# Altium schematic sheet MicroMod_SAMD51.SchDoc: MicroMod_SAMD51
size 457 x 318 mm; Origin: Eagle; Date: 5/10/2021 9:59:38 PM; SheetNumber: 1; DESIGNER: DESIGNER; REV: REV; GateName_1: G$1; SymbolName_1: FRAME_LEDGER; LibraryName: SparkFun-Aesthetics; DeviceSetName: FRAME-LEDGER; GateName_2: G$2; SymbolName_2: DOCFIELD; Sheet: Sheet:; ReleasedundertheCreativeCommons: Released under the Creative Commons; AttributionShare-Alike4.0License: Attribution Share-Alike 4.0 License; https://creativecommons.org/licenses/by-sa/4.0/: https://creativecommons.org/licenses/by-sa/4.0/; Designby: Design by:
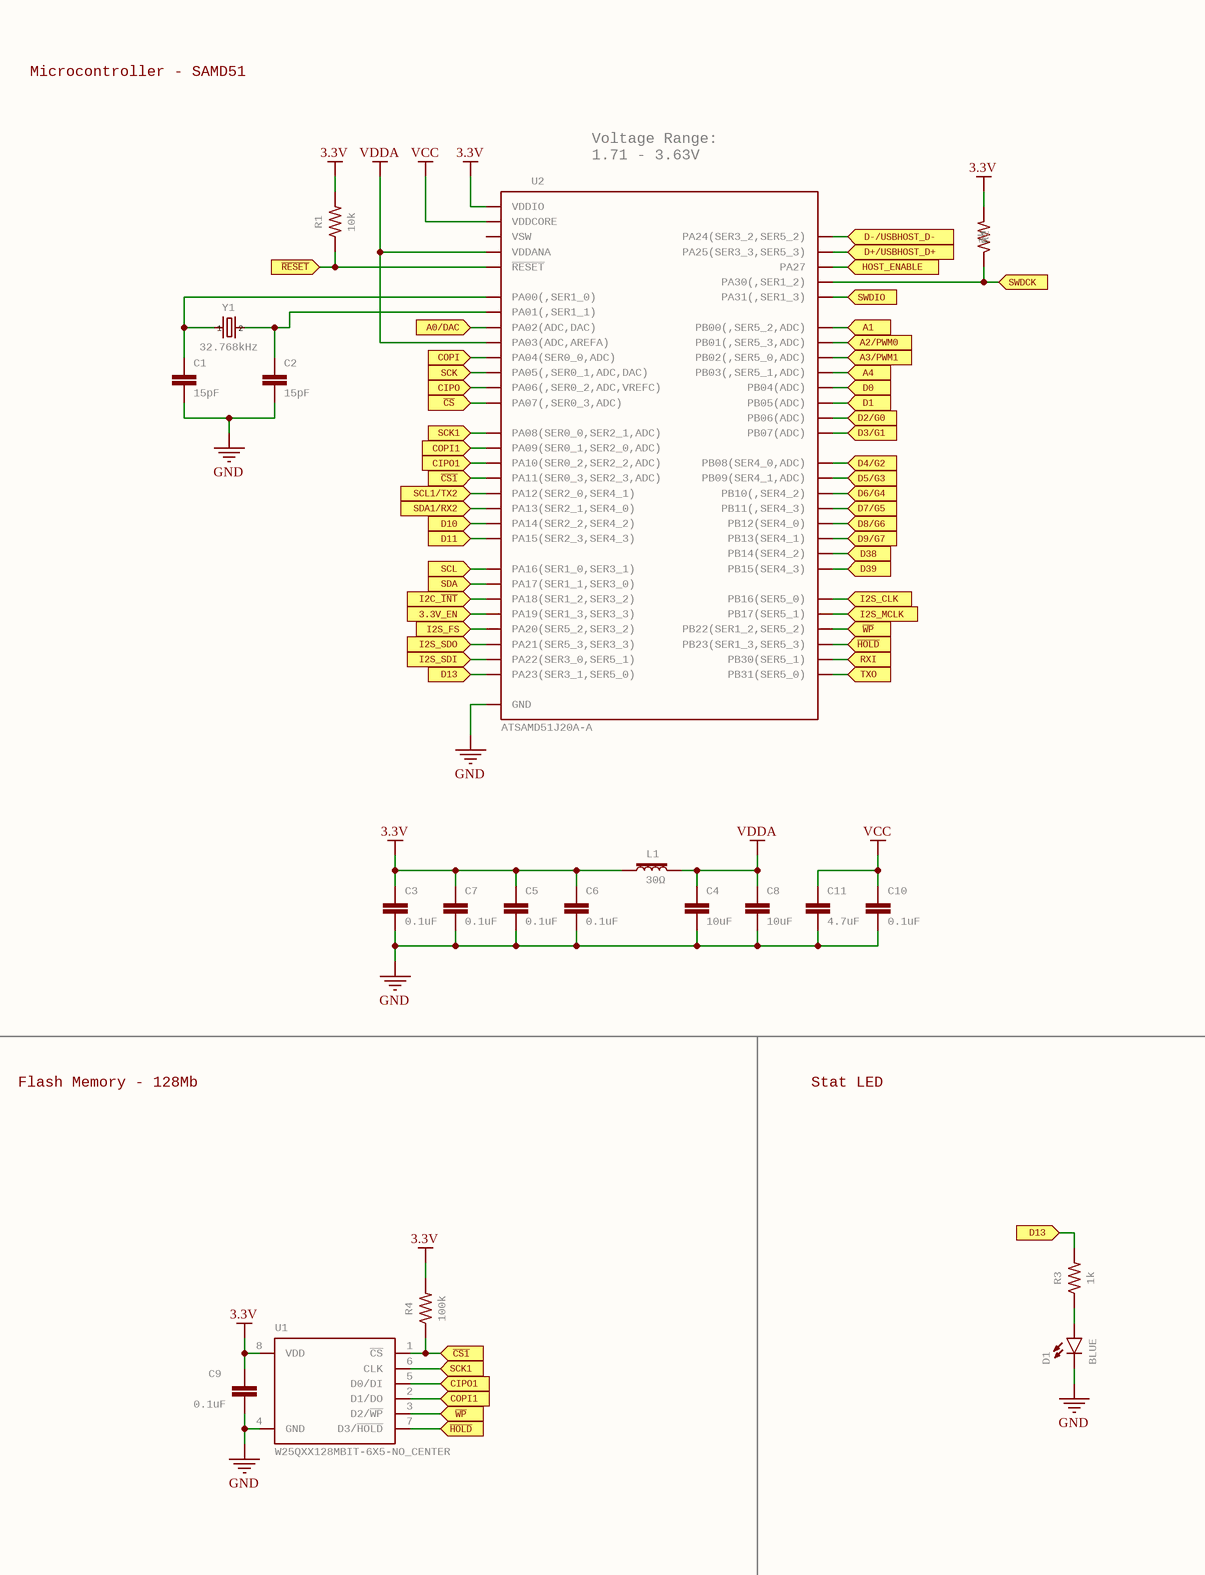
[diagram p0: MicroMod_SAMD51.SchDoc, left]
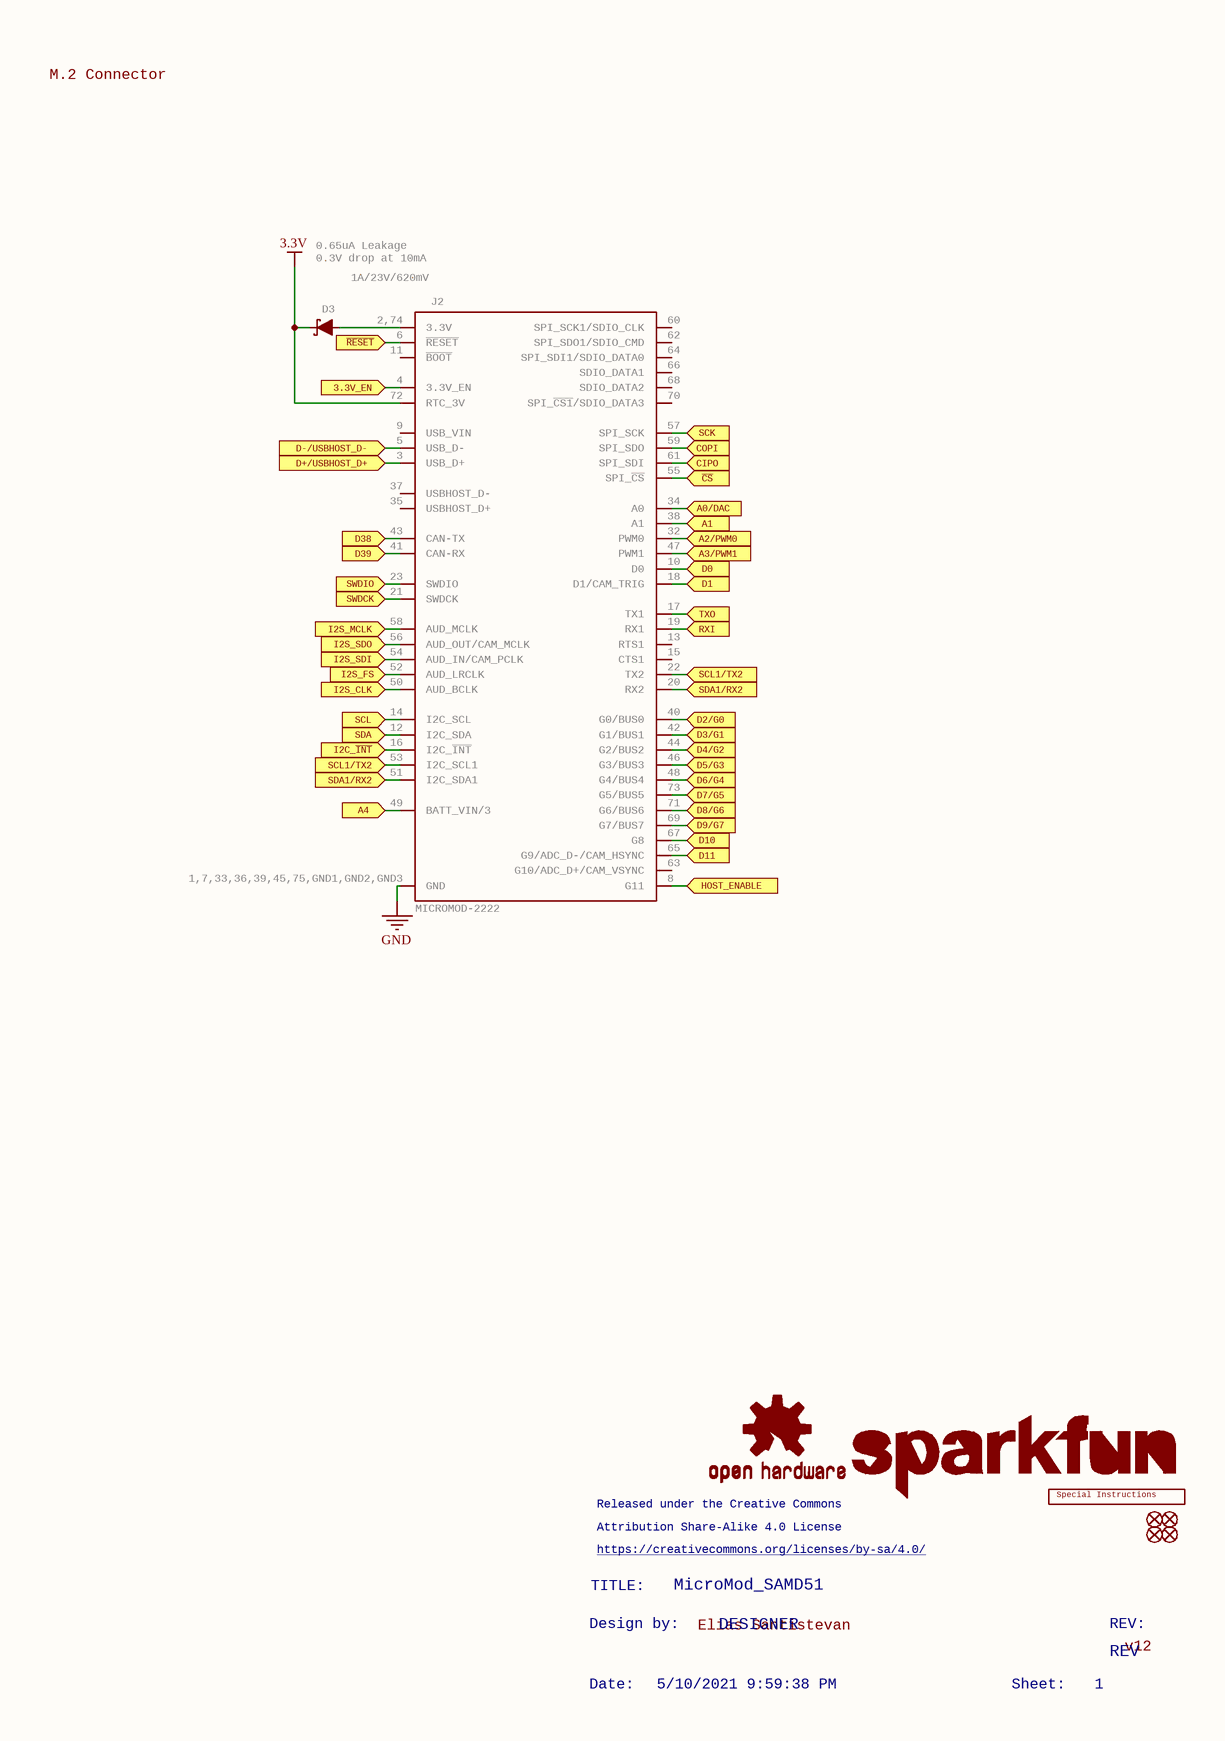
[diagram p1: MicroMod_SAMD51.SchDoc, right]

## Parts
C1  15pF  [0402-TIGHT]
C2  15pF  [0402-TIGHT]
C3  0.1uF  [0402-TIGHT]
C4  10uF  [0402-TIGHT]
C5  0.1uF  [0402-TIGHT]
C6  0.1uF  [0402-TIGHT]
C7  0.1uF  [0402-TIGHT]
C8  10uF  [0402-TIGHT]
C9  0.1uF  [0402-TIGHT]
C10  0.1uF  [0402-TIGHT]
C11  4.7uF  [0402-TIGHT]
D1  BLUE  [LED-0603]
D3  1A/23V/620mV  [SOD-323]
FD5  FIDUCIALUFIDUCIAL  [FIDUCIAL-MICRO]  (value not drawn)
FD6  FIDUCIALUFIDUCIAL  [FIDUCIAL-MICRO]  (value not drawn)
FD7  FIDUCIALUFIDUCIAL  [FIDUCIAL-MICRO]  (value not drawn)
FD8  FIDUCIALUFIDUCIAL  [FIDUCIAL-MICRO]  (value not drawn)
J2  MICROMOD-2222  [M.2-CARD-E-22]
L1  30Ω  [0402-TIGHT]
LOGO2  OSHW-LOGOMINI  [OSHW-LOGO-MINI]  (value not drawn)
LOGO5  SpecialInstructions: Special Instructions  [ORDERING_INSTRUCTIONS]  (hidden comment: SPECIAL_INSTRUCTIONS-ORDERING)
LOGO6  SFE_LOGO_NAME.1_INCH  [SFE_LOGO_NAME_.1]  (value not drawn)
R1  10k  [0402-TIGHT]
R2  1k  [0402-TIGHT]
R3  1k  [0402-TIGHT]
R4  100k  [0402-TIGHT]
U1  W25QXX128MBIT-6X5-NO_CENTER  [WSON-8-6X5-NO_CENTERPAD]
U2  ATSAMD51J20A-A  [TQFP64]
Y1  32.768kHz  [CRYSTAL-SMD-3.2X1.5MM]

## Ports
3.3V_EN (in), A0/DAC (in), A1 (in), A2/PWM0 (in), A3/PWM1 (in), A4 (in), CIPO1 (in), CIPO (in), COPI1 (in), COPI (in), D0 (in), D1 (in), D2/G0 (in), D3/G1 (in), D4/G2 (in), D5/G3 (in), D6/G4 (in), D7/G5 (in), D8/G6 (in), D9/G7 (in), D10 (in), D11 (in), D13 (in), D38 (in), D39 (in), D+/USBHOST_D+ (in), D-/USBHOST_D- (in), HOST_ENABLE (in), I2C_~{INT} (in), I2S_CLK (in), I2S_FS (in), I2S_MCLK (in), I2S_SDI (in), I2S_SDO (in), RXI (in), SCK1 (in), SCK (in), SCL1/TX2 (in), SCL (in), SDA1/RX2 (in), SDA (in), SWDCK (in), SWDIO (in), TXO (in), ~{CS1} (in), ~{CS} (in), ~{HOLD} (in), ~{RESET} (in), ~{WP} (in)

## Nets
3.3V: C3.1 C5.1 C6.1 C7.1 C9.1 D3.C J2.72(RTC_3V) L1.1 R1.2 R2.2 R4.2 U1.8(VDD) U2.21,34,48,56(VDDIO)
GND: C1.2 C2.2 C3.2 C4.2 C5.2 C6.2 C7.2 C8.2 C9.2 C10.2 C11.2 D1.C J2.1,7,33,36,39,45,75,GND1,GND2,GND3(GND) U1.4(GND) U2.7,22,33,47,54(GND)
VCC: C10.1 C11.1 U2.53(VDDCORE)
VDDA: C4.1 C8.1 L1.2 U2.4(PA03(ADC,AREFA)) U2.8(VDDANA)
3.3V_EN: J2.4(3.3V_EN) U2.38(PA19(SER1_3,SER3_3)) ; port 3.3V_EN
A0/DAC: J2.34(A0) U2.3(PA02(ADC,DAC)) ; port A0/DAC
A1: J2.38(A1) U2.61(PB00(,SER5_2,ADC)) ; port A1
A2/PWM0: J2.32(PWM0) U2.62(PB01(,SER5_3,ADC)) ; port A2/PWM0
A3/PWM1: J2.47(PWM1) U2.63(PB02(,SER5_0,ADC)) ; port A3/PWM1
A4: J2.49(BATT_VIN/3) U2.64(PB03(,SER5_1,ADC)) ; port A4
~{CS}: J2.55(SPI_~{CS}) U2.16(PA07(,SER0_3,ADC)) ; port ~{CS}
~{CS1}: R4.1 U1.1(~{CS}) U2.20(PA11(SER0_3,SER2_3,ADC)) ; port ~{CS1}
CIPO: J2.61(SPI_SDI) U2.15(PA06(,SER0_2,ADC,VREFC)) ; port CIPO
CIPO1: U1.5(D0/DI) U2.19(PA10(SER0_2,SER2_2,ADC)) ; port CIPO1
COPI: J2.59(SPI_SDO) U2.13(PA04(SER0_0,ADC)) ; port COPI
COPI1: U1.2(D1/DO) U2.18(PA09(SER0_1,SER2_0,ADC)) ; port COPI1
D0: J2.10(D0) U2.5(PB04(ADC)) ; port D0
D1: J2.18(D1/CAM_TRIG) U2.6(PB05(ADC)) ; port D1
D2/G0: J2.40(G0/BUS0) U2.9(PB06(ADC)) ; port D2/G0
D3/G1: J2.42(G1/BUS1) U2.10(PB07(ADC)) ; port D3/G1
D4/G2: J2.44(G2/BUS2) U2.11(PB08(SER4_0,ADC)) ; port D4/G2
D5/G3: J2.46(G3/BUS3) U2.12(PB09(SER4_1,ADC)) ; port D5/G3
D6/G4: J2.48(G4/BUS4) U2.23(PB10(,SER4_2)) ; port D6/G4
D7/G5: J2.73(G5/BUS5) U2.24(PB11(,SER4_3)) ; port D7/G5
D8/G6: J2.71(G6/BUS6) U2.25(PB12(SER4_0)) ; port D8/G6
D9/G7: J2.69(G7/BUS7) U2.26(PB13(SER4_1)) ; port D9/G7
D10: J2.67(G8) U2.31(PA14(SER2_2,SER4_2)) ; port D10
D11: J2.65(G9/ADC_D-/CAM_HSYNC) U2.32(PA15(SER2_3,SER4_3)) ; port D11
D13: R3.2 U2.44(PA23(SER3_1,SER5_0)) ; port D13
D38: J2.43(CAN-TX) U2.27(PB14(SER4_2)) ; port D38
D39: J2.41(CAN-RX) U2.28(PB15(SER4_3)) ; port D39
D+/USBHOST_D+: J2.3(USB_D+) U2.46(PA25(SER3_3,SER5_3)) ; port D+/USBHOST_D+
D-/USBHOST_D-: J2.5(USB_D-) U2.45(PA24(SER3_2,SER5_2)) ; port D-/USBHOST_D-
~{HOLD}: U1.7(D3/~{HOLD}) U2.50(PB23(SER1_3,SER5_3)) ; port ~{HOLD}
HOST_ENABLE: J2.8(G11) U2.51(PA27) ; port HOST_ENABLE
I2C_~{INT}: J2.16(I2C_~{INT}) U2.37(PA18(SER1_2,SER3_2)) ; port I2C_~{INT}
I2S_CLK: J2.50(AUD_BCLK) U2.39(PB16(SER5_0)) ; port I2S_CLK
I2S_FS: J2.52(AUD_LRCLK) U2.41(PA20(SER5_2,SER3_2)) ; port I2S_FS
I2S_MCLK: J2.58(AUD_MCLK) U2.40(PB17(SER5_1)) ; port I2S_MCLK
I2S_SDI: J2.54(AUD_IN/CAM_PCLK) U2.43(PA22(SER3_0,SER5_1)) ; port I2S_SDI
I2S_SDO: J2.56(AUD_OUT/CAM_MCLK) U2.42(PA21(SER5_3,SER3_3)) ; port I2S_SDO
~{RESET}: J2.6(~{RESET}) R1.1 U2.52(~{RESET}) ; port ~{RESET}
RXI: J2.19(RX1) U2.59(PB30(SER5_1)) ; port RXI
SCK: J2.57(SPI_SCK) U2.14(PA05(,SER0_1,ADC,DAC)) ; port SCK
SCK1: U1.6(CLK) U2.17(PA08(SER0_0,SER2_1,ADC)) ; port SCK1
SCL: J2.14(I2C_SCL) U2.35(PA16(SER1_0,SER3_1)) ; port SCL
SCL1/TX2: J2.22(TX2) J2.53(I2C_SCL1) U2.29(PA12(SER2_0,SER4_1)) ; port SCL1/TX2
SDA: J2.12(I2C_SDA) U2.36(PA17(SER1_1,SER3_0)) ; port SDA
SDA1/RX2: J2.20(RX2) J2.51(I2C_SDA1) U2.30(PA13(SER2_1,SER4_0)) ; port SDA1/RX2
SWDCK: J2.21(SWDCK) R2.1 U2.57(PA30(,SER1_2)) ; port SWDCK
SWDIO: J2.23(SWDIO) U2.58(PA31(,SER1_3)) ; port SWDIO
TXO: J2.17(TX1) U2.60(PB31(SER5_0)) ; port TXO
~{WP}: U1.3(D2/~{WP}) U2.49(PB22(SER1_2,SER5_2)) ; port ~{WP}
NetC1_1: C1.1 U2.1(PA00(,SER1_0)) Y1.P$1
NetC2_1: C2.1 U2.2(PA01(,SER1_1)) Y1.P$2
NetD1_A: D1.A R3.1
NetD3_A: D3.A J2.2,74(3.3V)

Not connected (* = marked no-connect by the designer): J2 9(USB_VIN) 11(~{BOOT}) 13(RTS1) 15(CTS1) 35(USBHOST_D+) 37(USBHOST_D-) 60(SPI_SCK1/SDIO_CLK) 62(SPI_SDO1/SDIO_CMD) 63(G10/ADC_D+/CAM_VSYNC) 64(SPI_SDI1/SDIO_DATA0) 66(SDIO_DATA1) 68(SDIO_DATA2) 70(SPI_~{CS1}/SDIO_DATA3); U2 55(VSW)

## Notes on the sheet
- Microcontroller - SAMD51
- M.2 Connector
- (near U2) Voltage Range:
  1.71 - 3.63V
- 0.65uA Leakage
  0.3V drop at 10mA
- Flash Memory - 128Mb
- Stat LED
- (near LOGO6) Released under the Creative Commons
- TITLE:
- (near LOGO6) Attribution Share-Alike 4.0 License
- (near LOGO6) https://creativecommons.org/licenses/by-sa/4.0/
- MicroMod_SAMD51
- Design by:
- Elias Santistevan
- DESIGNER
- REV:
- REV
- v12
- Date:
- 5/10/2021 9:59:38 PM
- Sheet:
- 1

## Library data of the parts
C1 C2 = 15PF-0402T-50V-5%: 15pF ceramic capacitors    A capacitor is a passive two-terminal electrical component used to store electrical energy temporarily in an electric field.; GateName_1: G$1; SymbolName_1: CAP; PROD_ID: CAP-13063; DeviceName: -0402T-50V-5%; LibraryName: SparkFun-Capacitors; DeviceSetName: 15PF
C3 C5-C7 C9 C10 = 0.1UF-0402T-10V-10%-X7R: 0.1ÂµF ceramic capacitors    A capacitor is a passive two-terminal electrical component used to store electrical energy temporarily in an electric field.; GateName_1: G$1; SymbolName_1: CAP; PROD_ID: CAP-15083; DeviceName: -0402T-10V-10%-X7R; LibraryName: SparkFun-Capacitors; DeviceSetName: 0.1UF
C4 C8 = 10UF-0402T-6.3V-20%: 10.0ÂµF ceramic capacitors    A capacitor is a passive two-terminal electrical component used to store electrical energy temporarily in an electric field.; GateName_1: G$1; SymbolName_1: CAP; PROD_ID: CAP-14848; DeviceName: -0402T-6.3V-20%; LibraryName: SparkFun-Capacitors; DeviceSetName: 10UF
C11 = 4.7UF-0402_TIGHT-6.3V-20%-X5R: 4.7ÂµF ceramic capacitors    A capacitor is a passive two-terminal electrical component used to store electrical energy temporarily in an electric field.; GateName_1: G$1; SymbolName_1: CAP; PROD_ID: CAP-14240; DeviceName: -0402_TIGHT-6.3V-20%-X5R; LibraryName: SparkFun-Capacitors; DeviceSetName: 4.7UF
D1 = LED-BLUE0603: Blue SMD LED    Used in manufacturing of various products at SparkFun   Packages: 0603 - SMD 0603 package [Product Link]  1206 - SMD1206  package [Product Link]    SparkFun Products: ESP8266 Thing-Dev Board  RedBoard; GateName_1: G$1; DeviceName: 0603; PROD_ID: DIO-08575; SymbolName_1: LED; LibraryName: SparkFun-LED; DeviceSetName: LED-BLUE
D3 = DIODE-SCHOTTKY-BAT20J: Schottky diode    A Schottky diode is a semiconductor diode which has a low forward voltage drop and a very fast switching action.; GateName_1: G$1; PROD_ID: DIO-11623; SymbolName_1: DIODE-SCHOTTKY; DeviceName: -BAT20J; LibraryName: SparkFun-DiscreteSemi; DeviceSetName: DIODE-SCHOTTKY
FD5-FD8 = FIDUCIALUFIDUCIAL: Fiducial Alignment Points    Point-of-reference for pick-and-place machines and other optical instruments.; GateName_1: G$1; SymbolName_1: FIDUCIAL; DeviceName: UFIDUCIAL; LibraryName: SparkFun-Aesthetics; DeviceSetName: FIDUCIAL
J2 = MICROMOD-2222: MicroMod Connector  Description: A card edge connector and mating PCB connector to allow various MicroMod Processor Boards to be coupled with various carrier boards of different capabilities. Based on the M.2 standard.; GateName_1: J1; DeviceName: -2222; SymbolName_1: MICROMOD; LibraryName: SparkFun-MicroMod; DeviceSetName: MICROMOD
L1 = FERRITE_BEAD-0402-30OHM-100MHZ: Ferrite Bead (blocks, cores, rings, chokes, etc.)    Inductor with layers of ferrite used to suppress high frequencies. Often used to isolate high frequency noise.   SparkFun Products:  IOIO-OTG - V2.2  SparkFun SAMD21 Mini Breakout  SparkFun 6 Degrees of Freedom Breakout - LSM6DS3  SparkFun SAMD21 Dev Breakout; GateName_1: G$1; PROD_ID: NDUC-15133; SymbolName_1: FERRITE_BEAD; DeviceName: -0402-30OHM-100MHZ; LibraryName: SparkFun-Coils; DeviceSetName: FERRITE_BEAD
LOGO2 = OSHW-LOGOMINI: Open-Source Hardware (OSHW) Logo     This logo indicates the piece of hardware it is found on incorporates a OSHW license and/or adheres to the definition of open source hardware found here: http://freedomdefined.org/OSHW; GateName_1: G$1; DeviceName: MINI; SymbolName_1: OSHW-LOGO; LibraryName: SparkFun-Aesthetics; DeviceSetName: OSHW-LOGO
LOGO5 = SPECIAL_INSTRUCTIONS-ORDERING: Special Ordering/Production Instructions Alert    Symbol for special PCB ordering instructions or unique production process warnings.      Ordering InstructionsProduction Instructions      Types of information that should be added to box: Copper weight  Soldermask color  Silk color  PCB thickness  Number of layers       PCB Standard: 1.6mm FR4  1 oz copper  immersion silver plating  red soldermask  white silkscreen    	   Types of information that should be added to box: Special wash requirements  Depaneling instructions  Humidification  Glue curing    	   Default text settings: 0.07 inch  9% ratio  50% line distance; GateName_1: G$1; SymbolName_1: SPECIAL_INSTRUCTIONS; DeviceName: -ORDERING; LibraryName: SparkFun-Aesthetics; DeviceSetName: SPECIAL_INSTRUCTIONS
LOGO6 = SFE_LOGO_NAME.1_INCH: SparkFun Font Logo    This is the SparkFun name logo. The logo on the schematic will always be the same size; the package variant is the height of the flame part of the logo (or the height the flame would be, if it were drawn). Default layer for the logo on the board is tSilk.; GateName_1: G$1; SymbolName_1: SFE_LOGO_NAME; DeviceName: .1_INCH; LibraryName: SparkFun-Aesthetics; DeviceSetName: SFE_LOGO_NAME
R1 = 10KOHM-0402T-1/16W-1%: 10kÎ© resistor    A resistor is a passive two-terminal electrical component that implements electrical resistance as a circuit element. Resistors act to reduce current flow, and, at the same time, act to lower voltage levels within circuits. - Wikipedia; GateName_1: G$1; DeviceSetName: 10KOHM; PROD_ID: RES-14241; SymbolName_1: RESISTOR; DeviceName: -0402T-1/16W-1%; LibraryName: SparkFun-Resistors
R2 R3 = 1KOHM-0402T-1/16W-1%: 1kÎ© resistor    A resistor is a passive two-terminal electrical component that implements electrical resistance as a circuit element. Resistors act to reduce current flow, and, at the same time, act to lower voltage levels within circuits. - Wikipedia; GateName_1: G$1; DeviceSetName: 1KOHM; PROD_ID: RES-14342; SymbolName_1: RESISTOR; DeviceName: -0402T-1/16W-1%; LibraryName: SparkFun-Resistors
R4 = 100KOHM-0402T-1/16W-1%: 100kÎ© resistor    A resistor is a passive two-terminal electrical component that implements electrical resistance as a circuit element. Resistors act to reduce current flow, and, at the same time, act to lower voltage levels within circuits. - Wikipedia; GateName_1: G$1; PROD_ID: RES-13495; SymbolName_1: RESISTOR; DeviceName: -0402T-1/16W-1%; LibraryName: SparkFun-Resistors; DeviceSetName: 100KOHM
U1 = W25QXX128MBIT-6X5-NO_CENTER: GateName_1: U1; SymbolName_1: W25QXX; PROD_ID: IC-15107; DeviceName: 128MBIT-6X5-NO_CENTER; LibraryName: SparkFun-MicroMod; DeviceSetName: W25QXX
U2 = ATSAMD51J20A-A: GateName_1: G$1; PROD_ID: IC-13952; SymbolName_1: ATSAMD51J20; LibraryName: SparkFun-IC-Microcontroller; DeviceSetName: ATSAMD51J20A-A
Y1 = CRYSTAL-32.768KHZSMD-3.2X1.5: 32.768kHz Crystal  Frequency: 32.768kHz  Frequency Stability: &plusmn;20ppm  Load Capacitance: 12.5pF (PTH-2X6 & SMD-3.2X1.5), 6pF (SMD-2X6)       SparkFun Products: SparkFun BigTime Watch Kit  SparkFun nRF52832 Breakout  SparkFun Real Time Clock Module; GateName_1: G$1; PROD_ID: XTAL-13062; SymbolName_1: CRYSTAL; DeviceName: SMD-3.2X1.5; LibraryName: SparkFun-Clocks; DeviceSetName: CRYSTAL-32.768KHZ; 1: 1; 2: 2